# EasyEDA Pro project ProPrj_逆变电路（单相三相）_2026-01-25.epro, schematic Schematic1
Board Name: 三相逆变; Create Date: 2025-07-19; Page Name: P1; Project Name: 复刻_逆变电路; Schematic Name: Schematic1; Update Date: 2025-07-19; Company: 嘉立创EDA; Page Size: A4; Version: V1.0
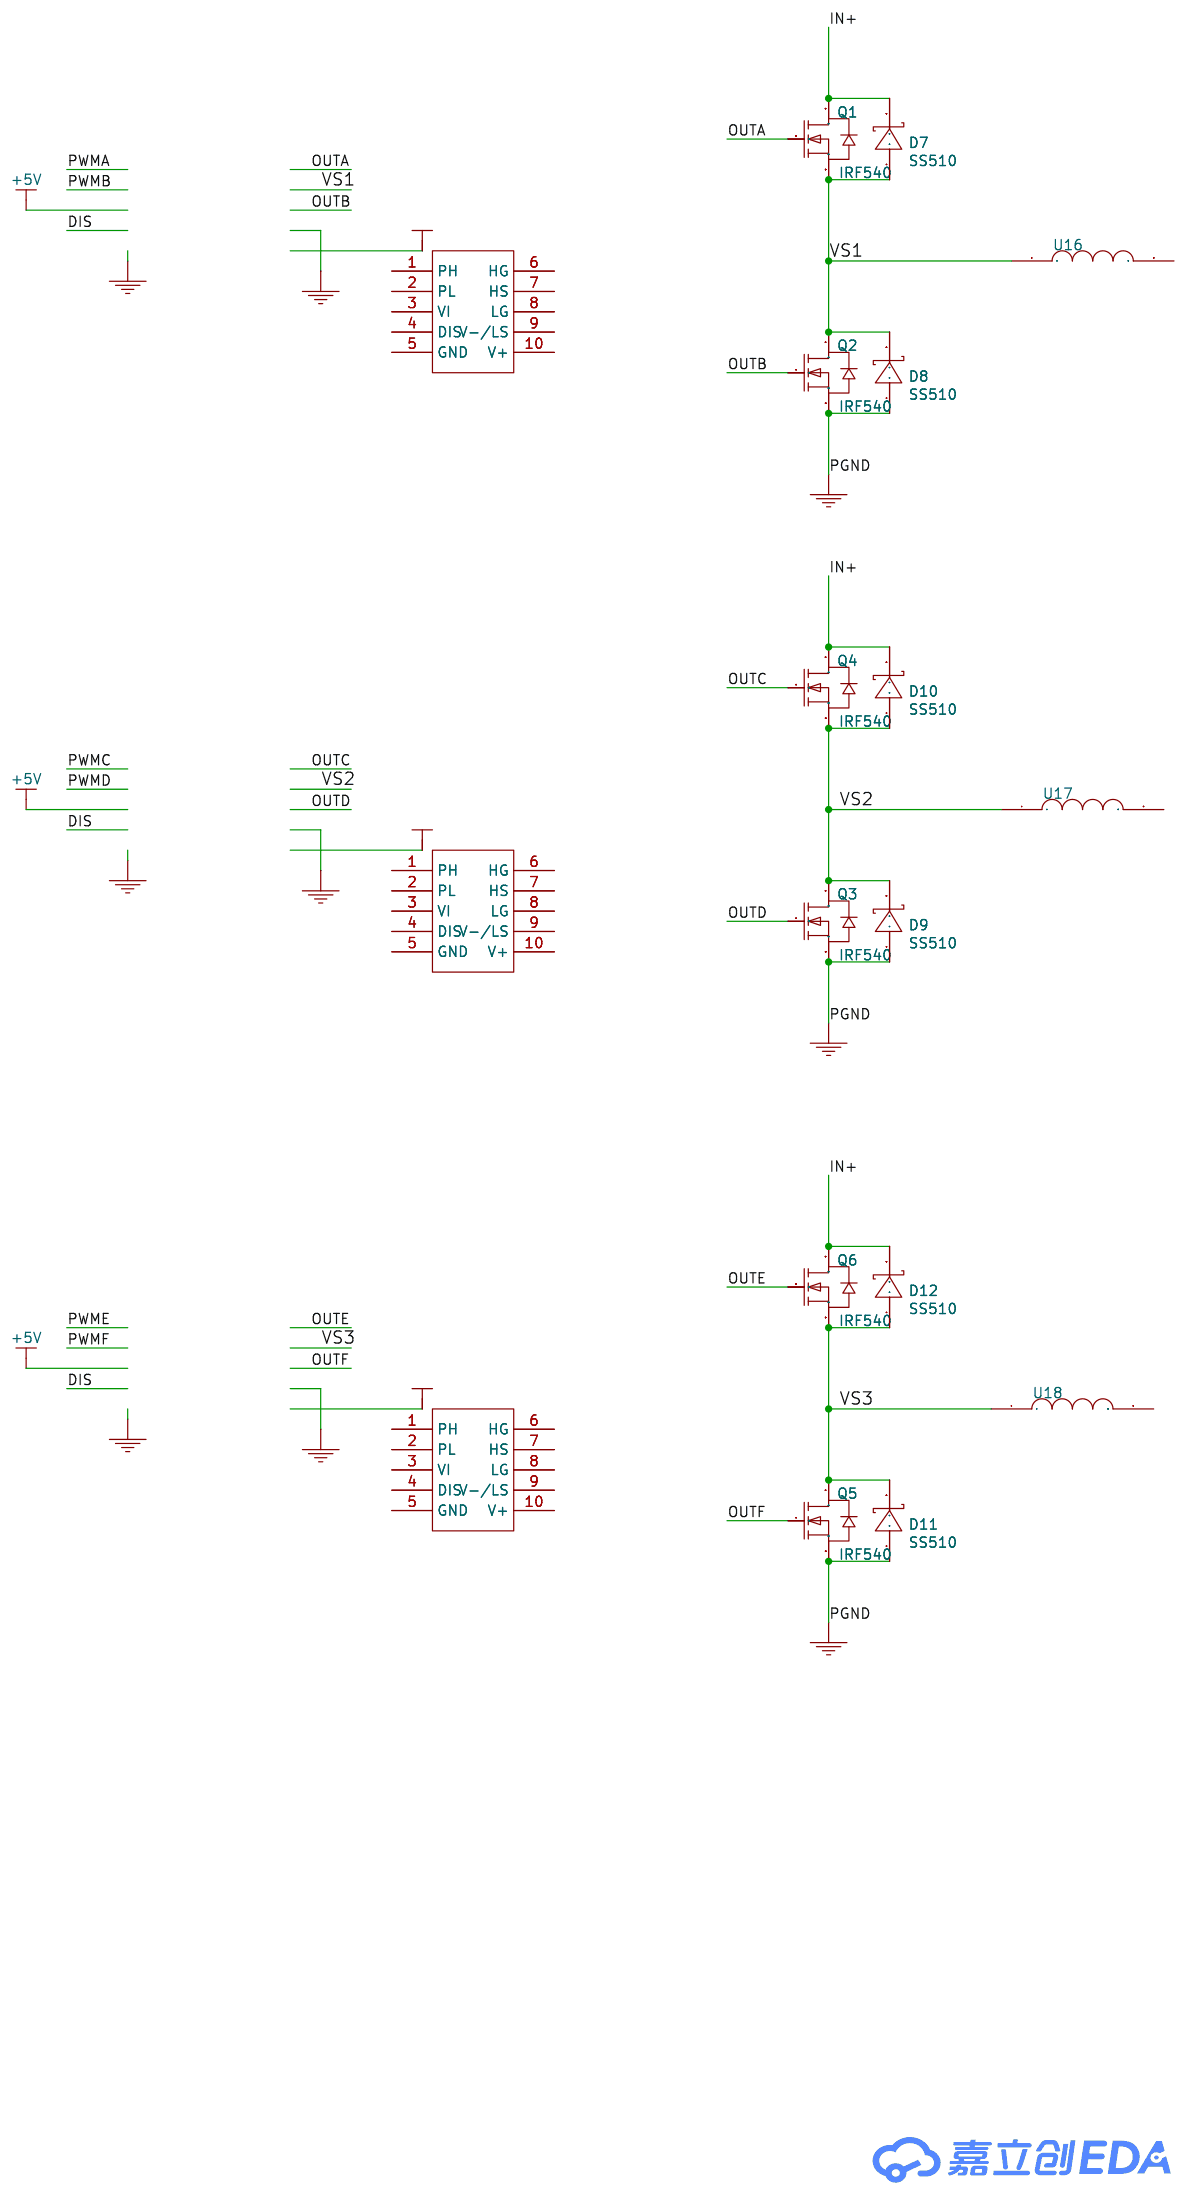
[diagram p0: schematic sheet]

## Parts
D7  SS510  [SMC_L7.1-W6.2-LS8.1-R-RD]
D8  SS510  [SMC_L7.1-W6.2-LS8.1-R-RD]
D9  SS510  [SMC_L7.1-W6.2-LS8.1-R-RD]
D10  SS510  [SMC_L7.1-W6.2-LS8.1-R-RD]
D11  SS510  [SMC_L7.1-W6.2-LS8.1-R-RD]
D12  SS510  [SMC_L7.1-W6.2-LS8.1-R-RD]
Q1  IRF540  [TO-220AB-3_L10.4-W4.6-P2.54-L]
Q2  IRF540  [TO-220AB-3_L10.4-W4.6-P2.54-L]
Q3  IRF540  [TO-220AB-3_L10.4-W4.6-P2.54-L]
Q4  IRF540  [TO-220AB-3_L10.4-W4.6-P2.54-L]
Q5  IRF540  [TO-220AB-3_L10.4-W4.6-P2.54-L]
Q6  IRF540  [TO-220AB-3_L10.4-W4.6-P2.54-L]
U13  -  [UCC21520模块]
U14  -  [UCC21520模块]
U15  -  [UCC21520模块]
U16  -
U17  -
U18  -

## Library data of the parts
D7-D12 = SS510: Supplier: LCSC; Manufacturer: MDD; Supplier Part: C19229; JLCPCB Part Class: Extended Part
Q1-Q6 = IRF540: Supplier: LCSC; Supplier Part: C533268; Manufacturer: Infineon Technologies; Manufacturer Part: AUIRF540Z; JLCPCB Part Class: Extended Part
U13-U15 = UCC21520驱动模块
U16-U18 = L_P14MM

## Nets
PGND: D8.1(A) D9.1(A) D11.1(A) Q2.3(S) Q3.3(S) Q5.3(S)
IN+: D7.2(K) D10.2(K) D12.2(K) Q1.2(D) Q4.2(D) Q6.2(D)
OUTA: Q1.1(G)
OUTB: Q2.1(G)
OUTC: Q4.1(G)
OUTD: Q3.1(G)
OUTE: Q6.1(G)
OUTF: Q5.1(G)
VS1: D7.1(A) D8.2(K) Q1.3(S) Q2.2(D) U16.1
VS2: D9.2(K) D10.1(A) Q3.2(D) Q4.3(S) U17.1
VS3: D11.2(K) D12.1(A) Q5.2(D) Q6.3(S) U18.1

Not connected (* = marked no-connect by the designer): U13 1(PH) 2(PL) 3(VI) 4(DIS) 5(GND) 6(HG) 7(HS) 8(LG) 9(V-/LS) 10(V+); U14 1(PH) 2(PL) 3(VI) 4(DIS) 5(GND) 6(HG) 7(HS) 8(LG) 9(V-/LS) 10(V+); U15 1(PH) 2(PL) 3(VI) 4(DIS) 5(GND) 6(HG) 7(HS) 8(LG) 9(V-/LS) 10(V+); U16 2; U17 2; U18 2
